# EAGLE design v2_guc_dagıtım_savasan (EAGLE 9.6.2)
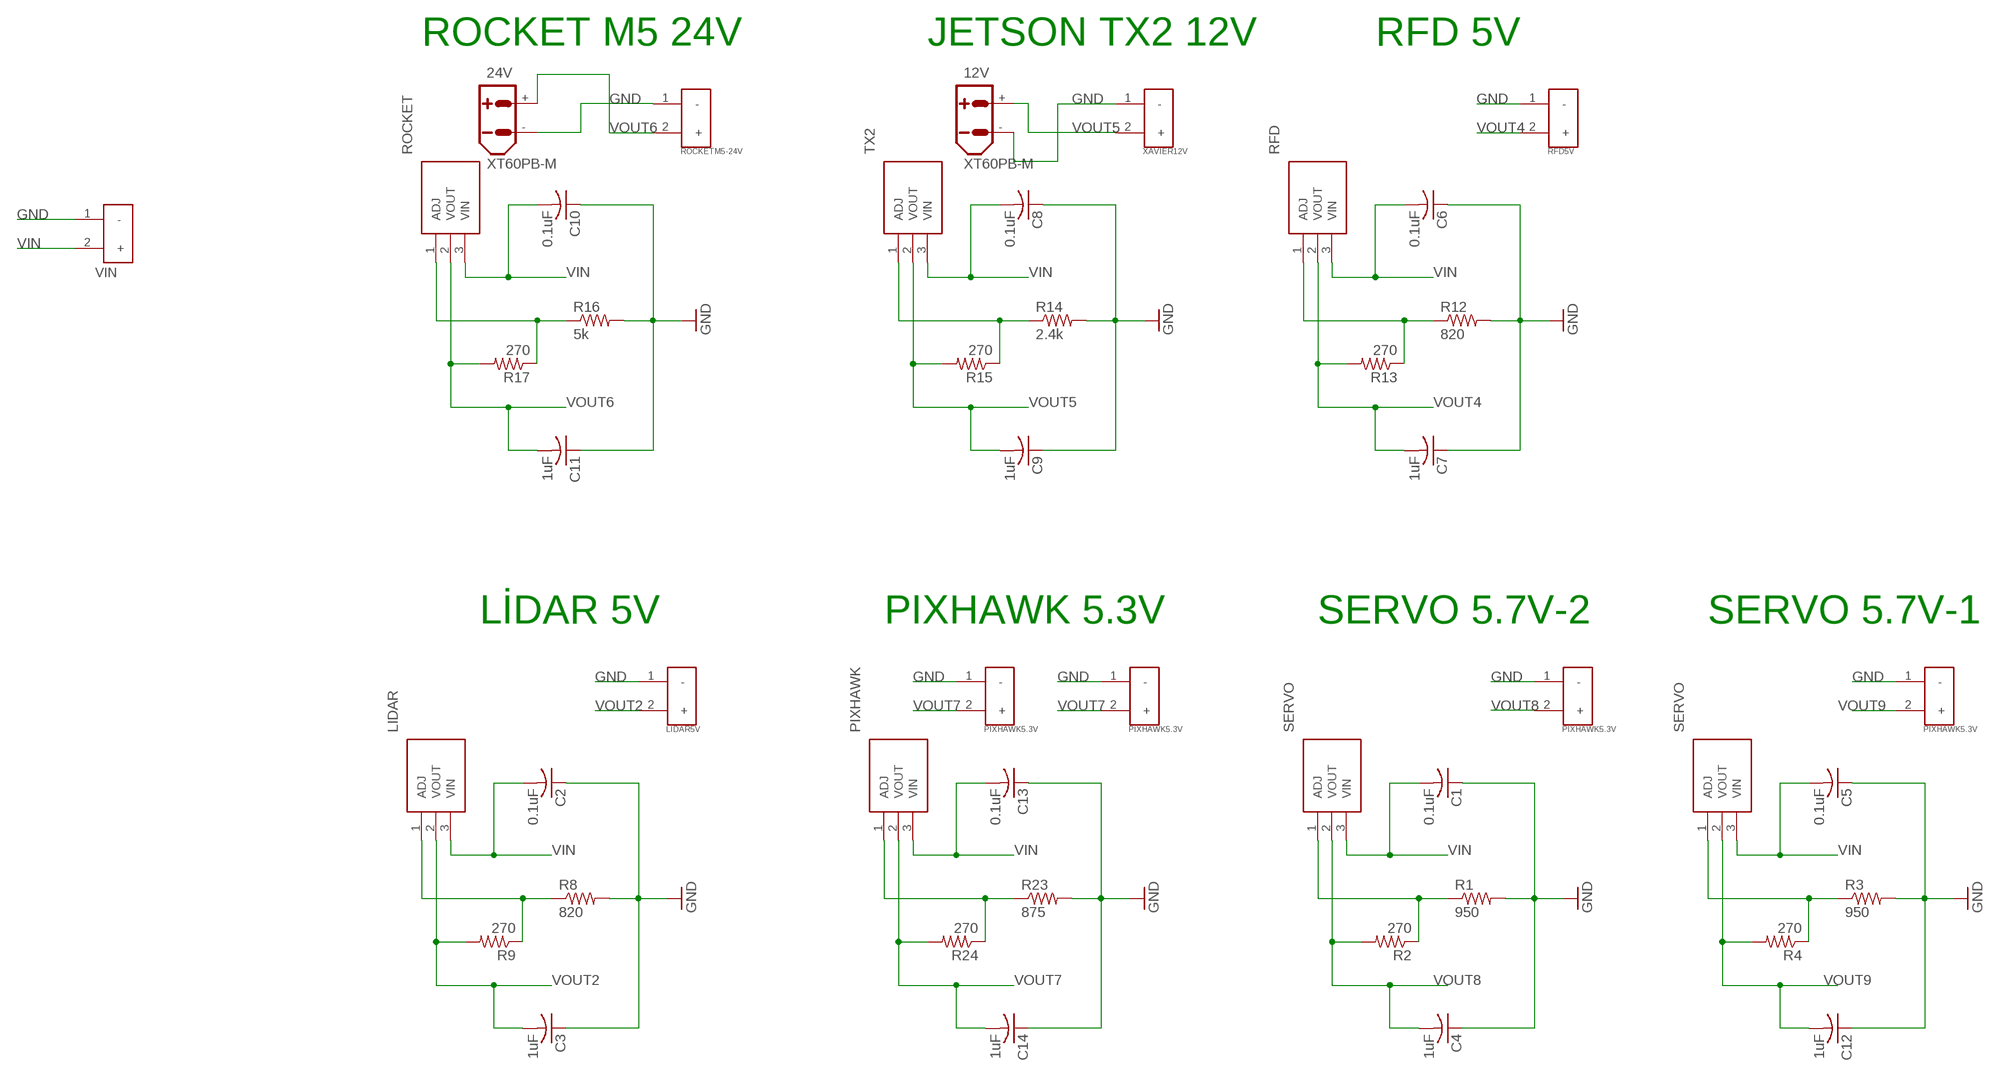
[diagram p0: schematic, sheet 1]

## Parts
12V  XT60PB-M  [XT60PB-M]
24V  XT60PB-M  [XT60PB-M]
C1  0.1uF  C-USC0402K  [C0402K]
C2  0.1uF  C-USC0402K  [C0402K]
C3  1uF  C-USC0402K  [C0402K]
C4  1uF  C-USC0402K  [C0402K]
C5  0.1uF  C-USC0402K  [C0402K]
C6  0.1uF  C-USC0402K  [C0402K]
C7  1uF  C-USC0402K  [C0402K]
C8  0.1uF  C-USC0402K  [C0402K]
C9  1uF  C-USC0402K  [C0402K]
C10  0.1uF  C-USC0402K  [C0402K]
C11  1uF  C-USC0402K  [C0402K]
C12  1uF  C-USC0402K  [C0402K]
C13  0.1uF  C-USC0402K  [C0402K]
C14  1uF  C-USC0402K  [C0402K]
IC5  LIDAR  LM338T_NOPB  [TO254P470X1028X1955-3P]
IC7  RFD  LM338T_NOPB  [TO254P470X1028X1955-3P]
IC8  TX2  LM338T_NOPB  [TO254P470X1028X1955-3P]
IC9  ROCKET  LM338T_NOPB  [TO254P470X1028X1955-3P]
IC13  PIXHAWK  LM338T_NOPB  [TO254P470X1028X1955-3P]
J3  VIN  XT60-M  [AMASS_XT60-M]
LIDAR5V  LIDAR5V  XT60-M  [AMASS_XT60-M]
PIXHAWK5.3V-1  PIXHAWK5.3V  XT60-M  [AMASS_XT60-M]
PIXHAWK5.3V-2  PIXHAWK5.3V  XT60-M  [AMASS_XT60-M]
R1  950  R-US_R0805  [R0805]
R2  270  R-US_R0805  [R0805]
R3  950  R-US_R0805  [R0805]
R4  270  R-US_R0805  [R0805]
R8  820  R-US_R0805  [R0805]
R9  270  R-US_R0805  [R0805]
R12  820  R-US_R0805  [R0805]
R13  270  R-US_R0805  [R0805]
R14  2.4k  R-US_R0805  [R0805]
R15  270  R-US_R0805  [R0805]
R16  5k  R-US_R0805  [R0805]
R17  270  R-US_R0805  [R0805]
R23  875  R-US_R0805  [R0805]
R24  270  R-US_R0805  [R0805]
RFD5V  RFD5V  XT60-M  [AMASS_XT60-M]
ROCKETM5-24V  ROCKETM5-24V  XT60-M  [AMASS_XT60-M]
SERVO5.7V-1  PIXHAWK5.3V  XT60-M  [AMASS_XT60-M]
SERVO5.7V-2  PIXHAWK5.3V  XT60-M  [AMASS_XT60-M]
SERVO-1  SERVO  LM338T_NOPB  [TO254P470X1028X1955-3P]
SERVO-2  SERVO  LM338T_NOPB  [TO254P470X1028X1955-3P]
TX2-12V  XAVIER12V  XT60-M  [AMASS_XT60-M]

## Nets
GND [asda]: 12V.- 24V.- C1.1 C2.1 C3.1 C4.1 C5.1 C6.1 C7.1 C8.1 C9.1 C10.1 C11.1 C12.1 C13.1 C14.1 J3.1(-) LIDAR5V.1(-) PIXHAWK5.3V-1.1(-) PIXHAWK5.3V-2.1(-) R1.2 R3.2 R8.2 R12.2 R14.2 R16.2 R23.2 RFD5V.1(-) ROCKETM5-24V.1(-) SERVO5.7V-1.1(-) SERVO5.7V-2.1(-) TX2-12V.1(-)
N$1: R1.1 R2.1 SERVO-2.1(ADJ)
N$2: R3.1 R4.1 SERVO-1.1(ADJ)
N$11: IC7.1(ADJ) R12.1 R13.1
N$12: IC5.1(ADJ) R8.1 R9.1
N$13: IC8.1(ADJ) R14.1 R15.1
N$14: IC9.1(ADJ) R16.1 R17.1
N$17: IC13.1(ADJ) R23.1 R24.1
VIN [asda]: C1.2 C2.2 C5.2 C6.2 C8.2 C10.2 C13.2 IC5.3(VIN) IC7.3(VIN) IC8.3(VIN) IC9.3(VIN) IC13.3(VIN) J3.2(+) SERVO-1.3(VIN) SERVO-2.3(VIN)
VOUT2: C3.2 IC5.2(VOUT) LIDAR5V.2(+) R9.2
VOUT4: C7.2 IC7.2(VOUT) R13.2 RFD5V.2(+)
VOUT5: 12V.+ C9.2 IC8.2(VOUT) R15.2 TX2-12V.2(+)
VOUT6: 24V.+ C11.2 IC9.2(VOUT) R17.2 ROCKETM5-24V.2(+)
VOUT7: C14.2 IC13.2(VOUT) PIXHAWK5.3V-1.2(+) PIXHAWK5.3V-2.2(+) R24.2
VOUT8: C4.2 R2.2 SERVO5.7V-2.2(+) SERVO-2.2(VOUT)
VOUT9: C12.2 R4.2 SERVO5.7V-1.2(+) SERVO-1.2(VOUT)

## Notes on the sheet
- ROCKET M5 24V | JETSON TX2 12V | RFD 5V
- LİDAR 5V | PIXHAWK 5.3V | SERVO 5.7V-2 | SERVO 5.7V-1

## Library data of the parts
12V 24V = amass:XT60: AMASS XT60 connector Store in Japan AMASS XT60 connector <https://szc.jp/ams-xt60>
C1-C14 = adafruit:C-US: CAPACITOR, American symbol
IC5 IC7-IC9 IC13 SERVO-1 SERVO-2 = LM338T_NOPB:LM338T_NOPB: 5 Amp Adjustable Regulator LM338T LM338T/NOPB, Voltage Regulator, 5A Adjustable 1.2 32 V, 25W, 3-Pin TO-220 Source: Datasheet <http://www.ti.com/lit/ds/symlink/lm338.pdf>; ARROW_PART_NUMBER: LM338T/NOPB; ARROW_PRICE-STOCK: https://www.arrow.com/en/products/lm338tnopb/texas-instruments; DESCRIPTION: 5 Amp Adjustable Regulator LM338T LM338T/NOPB, Voltage Regulator, 5A Adjustable 1.2 32 V, 25W, 3-Pin TO-220; HEIGHT: 4.7mm; MANUFACTURER_NAME: Texas Instruments; MANUFACTURER_PART_NUMBER: LM338T/NOPB; MOUSER_PART_NUMBER: 926-LM338T/NOPB; MOUSER_PRICE-STOCK: https://www.mouser.co.uk/ProductDetail/Texas-Instruments/LM338T-NOPB?qs=X1J7HmVL2ZENaH7%2FMvkSlw%3D%3D
J3 LIDAR5V PIXHAWK5.3V-1 PIXHAWK5.3V-2 RFD5V ROCKETM5-24V SERVO5.7V-1 SERVO5.7V-2 TX2-12V = XT60-M:XT60-M: DC supply; XT60; male; PIN:2; for cable; soldered; 60A; 500V; AVAILABILITY: Unavailable; DESCRIPTION: Plug; DC supply; XT60; male; PIN: 2; for cable; soldered; 30A; 500V; MF: AMASS; MP: XT60-M; PACKAGE: Package; PRICE: None
R1-R4 R8 R9 R12-R17 R23 R24 = adafruit:R-US_: RESISTOR, American symbol

## Net classes
1 asda: width 0.7 mm

## Board
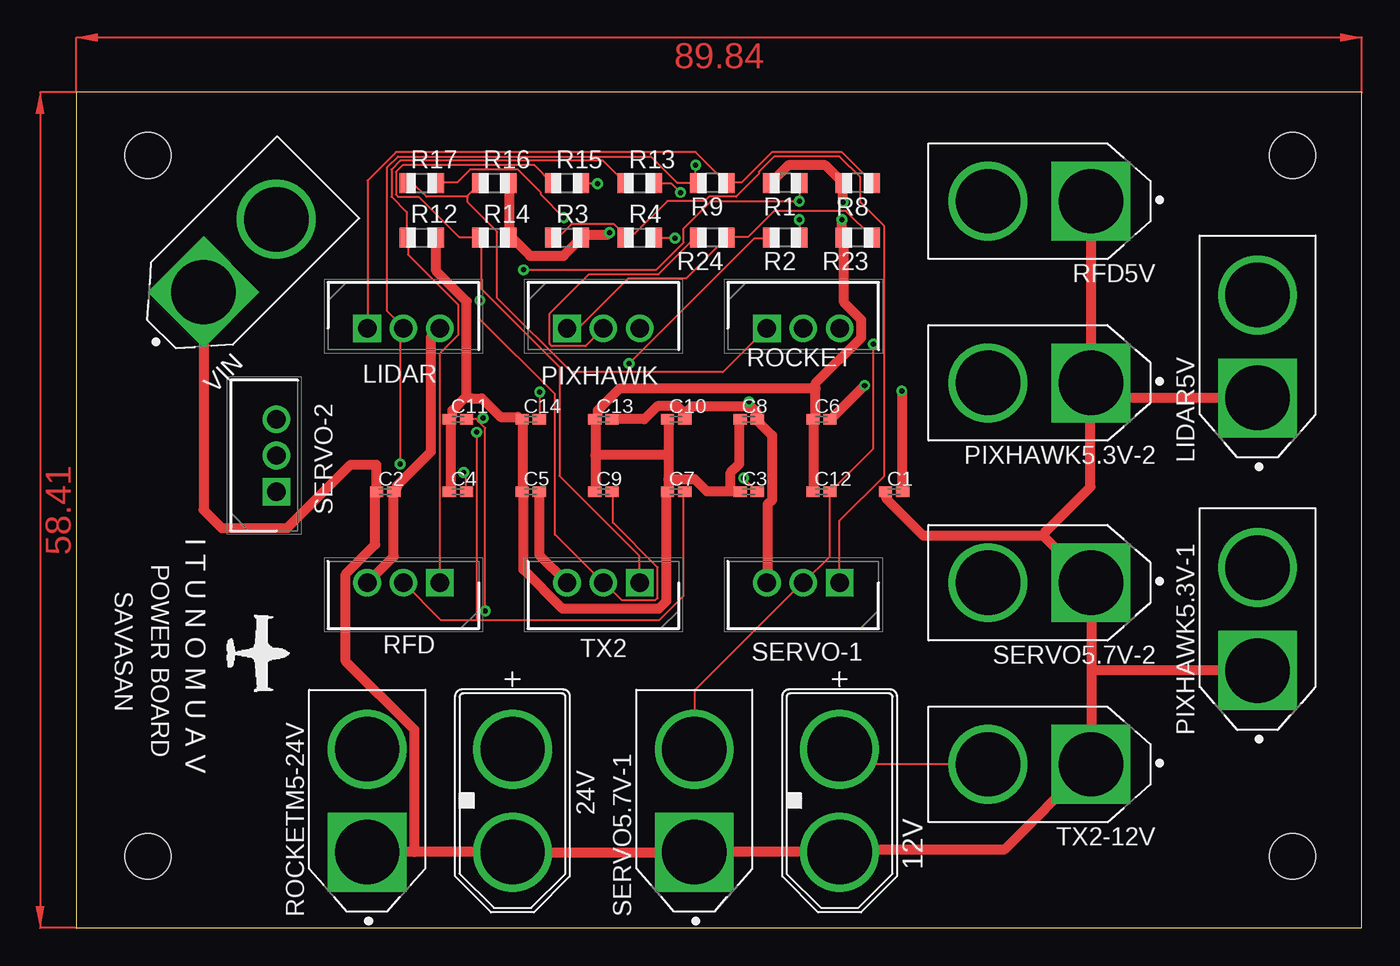
[diagram p1: board, top side]
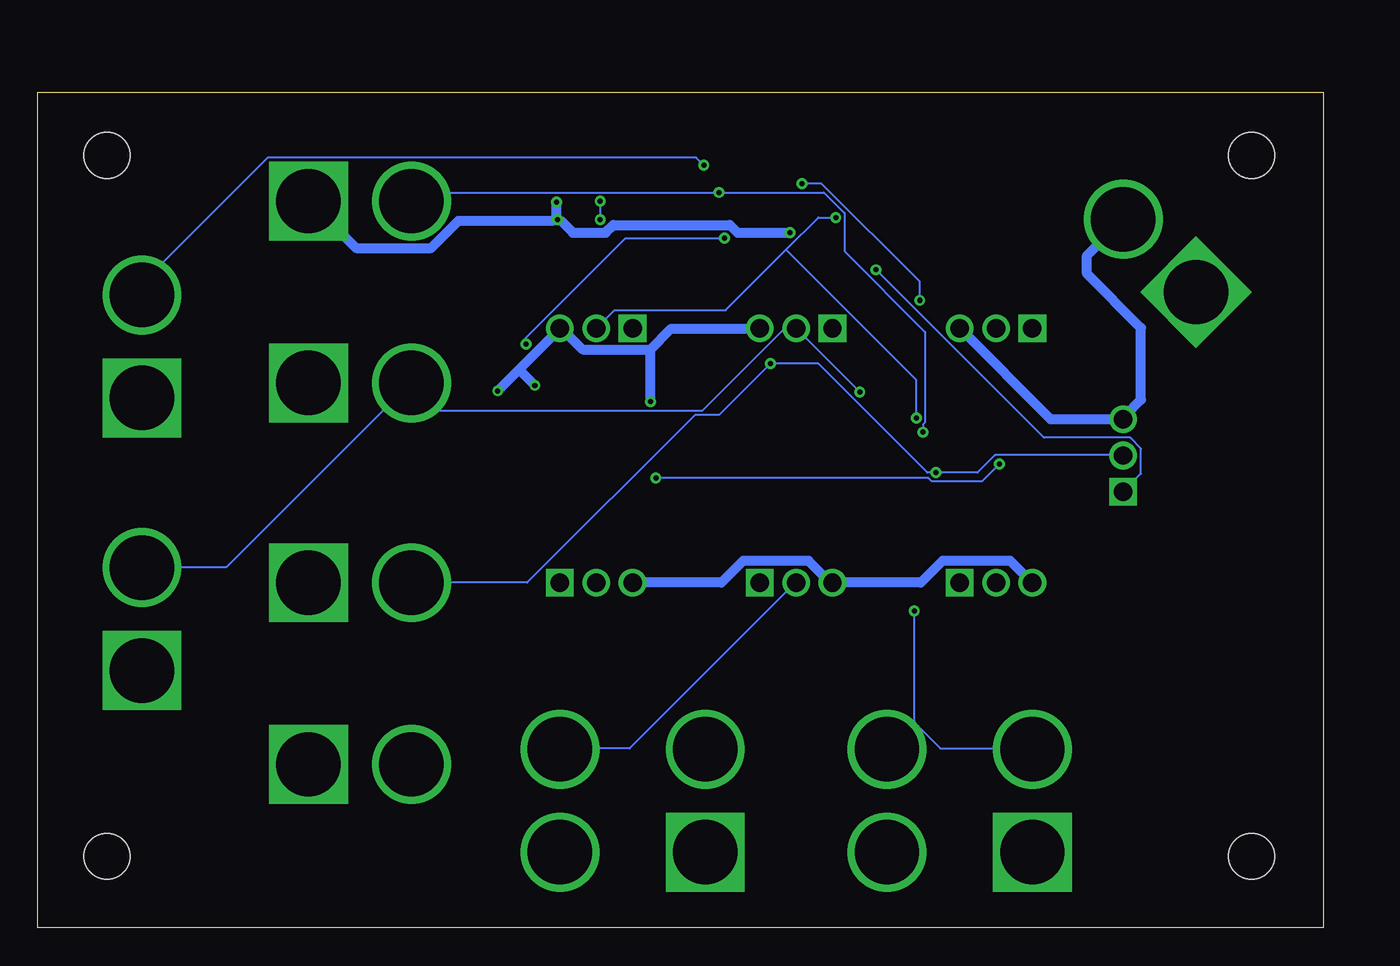
[diagram p2: board, bottom side, seen from below]

Size 89.84 x 58.41 mm. Coordinates in mm from the lower left corner, seen from the top.
Outline: 0,0 89.84,0 89.84,58.41 0,58.41 0,0
Copper layers (1*16): Top 0.035mm / dielectric 1.5mm / Bottom 0.035mm
Design rules "default *": minimum track width 6mil, minimum drill 0.35mm, track to track 6mil, track to pad 6mil, pad to pad 6mil, via to via 6mil, smd to smd 6mil, copper to edge 40mil, drill to drill 6mil, minimum pad ring 10mil, minimum via ring 8mil, stop-mask expansion 4mil, vias tented up to drill 0mil, thermal gap 10mil
Holes 3.2 mm at 5,54 5,5 85,5 85,54

### Footprints (pad centres in the part's own frame; a part is rotated, then mirrored left to right if it is on the bottom)
XT60PB-M = drill 4.5: + 3.6,0; - -3.6,0
C0402K = smd 0.925 x 0.74: 1 -0.6,0; 2 0.6,0
TO254P470X1028X1955-3P = drill 1.29 pad 1.935 square: 1 0,0 | drill 1.29 pad 1.935: 2 2.54,0; 3 5.08,0
AMASS_XT60-M = drill 4.5 square: 1 -3.6,0 | drill 4.5: 2 3.6,0
R0805 = smd 1.1 x 1.4: 1 -1,0; 2 1,0

### Placement (x,y rotation side)
12V  53.34,8.89 90 top
24V  30.48,8.89 90 top
C1  57.15,30.48 0 top
C2  21.59,30.48 0 top
C3  46.99,30.48 0 top
C4  26.67,30.48 0 top
C5  31.75,30.48 0 top
C6  52.07,35.56 0 top
C7  41.91,30.48 0 top
C8  46.99,35.56 0 top
C9  36.83,30.48 0 top
C10  41.91,35.56 0 top
C11  26.67,35.56 0 top
C12  52.07,30.48 0 top
C13  36.83,35.56 0 top
C14  31.75,35.56 0 top
IC5  20.32,41.91 0 top
IC7  25.4,24.13 180 top
IC8  39.37,24.13 180 top
IC9  48.26,41.91 0 top
IC13  34.29,41.91 0 top
J3  11.43,46.99 45 top
LIDAR5V  82.55,40.64 90 top
PIXHAWK5.3V-1  82.55,21.59 90 top
PIXHAWK5.3V-2  67.31,38.1 180 top
R1  49.53,52.07 180 top
R2  49.53,48.26 180 top
R3  34.29,48.26 0 top
R4  39.37,48.26 0 top
R8  54.61,52.07 180 top
R9  44.45,52.07 180 top
R12  24.13,48.26 0 top
R13  39.37,52.07 0 top
R14  29.21,48.26 0 top
R15  34.29,52.07 0 top
R16  29.21,52.07 0 top
R17  24.13,52.07 0 top
R23  54.61,48.26 180 top
R24  44.45,48.26 180 top
RFD5V  67.31,50.8 180 top
ROCKETM5-24V  20.32,8.89 90 top
SERVO5.7V-1  43.18,8.89 90 top
SERVO5.7V-2  67.31,24.13 180 top
SERVO-1  53.34,24.13 180 top
SERVO-2  13.97,30.48 90 top
TX2-12V  67.31,11.43 180 top

### Tracks (layer width: path | path; a pad name or v marks a point on that pad's centre or on a via)
GND  (via drill 0.35)
  Top 0.7: 23.62,5.31 30.48,5.31 24V.- 30.79,5.23 42.82,5.23 SERVO5.7V-1.1 43.2,5.31 53.34,5.31 12V.- 53.65,5.46 64.85,5.46 70.64,11.25 TX2-12V.1 70.94,11.48 70.94,18.03 | 23.62,5.31 20.34,5.31 ROCKETM5-24V.1 | 23.62,5.31 23.62,13.84 18.82,18.64 18.82,24.74 20.88,26.8 20.88,30.15 C2.1 20.95,30.53 20.95,32.36 20.93,32.38 19.18,32.38 14.73,27.94 10.16,27.94 8.88,29.22 J3.1 | C4.1 26.14,30.53 26.14,35.56 C11.1 26.29,35.87 26.29,36.17 27.28,37.16 | 27.28,37.16 27.28,43.79 25.15,45.92 25.15,48.21 R12.2 | 27.28,37.16 27.58,37.01 28.35,37.01 29.64,35.71 30.86,35.71 C14.1 31.17,35.56 31.17,30.53 C5.1 31.24,30.15 31.24,25.04 33.98,22.3 40.69,22.3 41.22,22.84 41.22,30.15 C7.1 41.38,30.53 41.38,31.37 | 36.27,33.05 36.27,35.56 C13.1 36.42,35.87 36.42,36.17 37.95,37.69 51.66,37.69 | 36.27,33.05 36.27,30.53 C9.1 | 41.38,33.05 41.38,35.56 C10.1 | 41.38,33.05 41.38,31.37 | 45.72,30.53 44.04,30.53 43.2,31.37 41.38,31.37 | 45.72,30.53 46.33,30.53 C3.1 | 45.72,30.53 45.72,31.83 46.33,32.44 46.33,35.56 C8.1 | 41.38,33.05 36.27,33.05 | R16.2 30.25,52.02 30.25,48.28 R14.2 30.56,48.13 31.7,46.99 34.06,46.99 35.28,48.21 R3.2 35.59,48.44 37.11,48.44 v37.26,48.59 | R1.2 48.54,52.09 49.76,53.31 52.35,53.31 53.57,52.09 R8.2 53.57,51.71 v53.57,50.72 | C12.1 51.51,30.53 51.51,35.56 C6.1 51.66,35.87 51.66,37.69 | 51.66,37.69 51.66,38.08 54.86,41.27 54.86,42.49 53.65,43.71 53.65,48.21 R23.2 53.49,48.59 v53.49,49.51 | 67.59,27.41 59.21,27.41 56.62,30 56.62,30.45 C1.1 | 67.59,27.41 70.87,24.13 SERVO5.7V-2.1 70.94,23.82 70.94,18.03 | 70.94,18.03 82.53,18.03 PIXHAWK5.3V-1.1 | PIXHAWK5.3V-2.1 70.87,38.08 70.87,30.84 67.74,27.71 67.59,27.41
  Top 0.7: LIDAR5V.1 82.53,37.08 71.17,37.08 PIXHAWK5.3V-2.1 | RFD5V.1 70.94,50.8 70.94,38.46 PIXHAWK5.3V-2.1
  Bottom 0.7: 53.57,49.58 v53.57,50.72 | 53.57,49.58 v53.49,49.51 53.19,49.35 52.43,48.59 50.14,48.59 49.61,49.12 41.45,49.12 40.92,48.59 v37.26,48.59 | 53.57,49.58 53.87,49.43 60.43,49.43 62.33,47.52 67.59,47.52 70.87,50.8 RFD5V.1
N$1  (via drill 0.35)
  Top 0.152: v50.52,49.51 50.52,48.28 R2.1 | R1.1 50.52,52.02 v50.52,50.8 44.35,50.8 42.44,48.9 42.44,47.9 40.54,46 v31.24,46
  Bottom 0.152: v50.52,50.8 v50.52,49.51 | v31.24,46 19.51,34.27 13.49,34.27 12.72,33.5 12.72,31.75 13.95,30.53 SERVO-2.1
N$2
  Top 0.152: R3.1 33.3,48.28 33.68,48.28 34.59,49.2 37.57,49.2 38.33,48.44 38.33,48.28 R4.1 38.33,48.51 39.01,48.51 41.3,50.8 43.89,50.8 44.2,51.1 46.1,51.1 47.7,52.7 47.7,52.86 48.77,53.92 53.34,53.92 54.79,52.48 54.79,50.72 56.46,49.05 56.46,31.6 53.34,28.47 SERVO-1.1
N$11
  Top 0.152: R13.1 38.33,52.09 36.8,53.62 22.63,53.62 22.02,53.01 22.02,51.1 23.09,50.04 23.09,48.28 R12.1 23.16,48.21 23.16,47.07 26.67,43.56 26.67,41.43 25.38,40.13 25.38,24.13 IC7.1
N$12
  Top 0.152: R8.1 55.63,52.09 53.49,54.23 48.62,54.23 46.48,52.09 45.49,52.09 R9.1 45.41,52.09 43.28,54.23 22.33,54.23 20.34,52.25 20.34,41.96 IC5.1
N$13
  Top 0.152: R15.1 33.22,52.09 32,53.31 22.78,53.31 22.33,52.86 22.33,51.26 22.48,51.1 23.93,51.1 26.75,48.28 28.19,48.28 R14.1 28.27,48.21 28.27,44.7 33.76,39.22 33.76,31.6 39.32,26.04 39.32,24.13 IC8.1
N$14
  Top 0.152: 27.32,51.14 28.19,52.02 R16.1 | 27.32,51.14 27.28,51.1 24.46,51.1 23.55,52.02 23.16,52.02 R17.1 | IC9.1 45.19,38.84 34.59,38.84 29.41,44.02 29.41,48.67 27.36,50.72 27.36,51.1 27.32,51.14
N$17
  Top 0.152: R23.1 55.63,48.28 53.8,50.11 48.77,50.11 46.94,48.28 45.49,48.28 R24.1 45.41,48.21 42.6,45.39 38.56,45.39 35.13,41.96 34.29,41.96 IC13.1
VIN  (via drill 0.35)
  Top 0.7: v57.68,37.54 57.68,30.53 C1.2 | v55.09,37.92 52.73,35.56 C6.2 | C13.2 39.7,35.56 40.62,36.47 41.99,36.47 42.44,36.02 | 42.44,36.02 42.44,35.56 C10.2 | 47.09,36.47 47.55,36.02 47.55,35.56 C8.2 47.78,35.26 48.62,34.42 48.62,29.92 48.31,29.62 48.31,24.13 SERVO-1.3 | 47.09,36.47 43.05,36.47 42.75,36.17 42.44,36.02 | IC8.3 32.38,26.04 32.38,30.45 C5.2 | IC7.3 20.34,24.13 22.17,25.96 22.17,30.45 C2.2 22.4,30.76 22.4,30.91 24.77,33.27 24.77,41.27 IC5.3 | v47.02,36.78 47.09,36.47
  Bottom 0.7: 56.2,39.03 53.34,41.88 IC9.3 53.03,41.73 51.74,40.44 47.02,40.44 | 56.2,39.03 v57.68,37.54 | 56.2,39.03 v55.09,37.92 | 47.02,40.44 45.57,41.88 39.4,41.88 IC13.3 | IC5.3 19.05,35.56 SERVO-2.3 13.79,35.87 12.72,36.93 12.72,41.94 16.51,45.72 16.51,47 J3.2 | IC7.3 20.34,24.13 21.87,25.65 26.59,25.65 28.12,24.13 IC8.3 34.59,24.28 35.97,25.65 40.54,25.65 42.06,24.13 SERVO-1.3 | v47.02,36.78 47.02,40.44
VOUT2  (via drill 0.35)
  Top 0.152: v46.63,31.45 47.55,30.53 C3.2 | v22.63,32.44 22.63,41.66 22.86,41.88 IC5.2 22.86,41.96 21.72,43.1 21.72,53.16 22.48,53.92 40.16,53.92 41.99,52.09 43.28,52.09 | 43.28,52.09 43.43,52.09 R9.2 43.28,52.09 | 43.28,52.09 v43.28,53.31
  Bottom 0.152: v46.63,31.45 27.58,31.45 27.36,31.22 23.85,31.22 v22.63,32.44 | v43.28,53.31 43.81,53.85 73.76,53.85 82.53,45.09 82.53,44.25 LIDAR5V.2
VOUT4  (via drill 0.35)
  Top 0.152: 27.96,21.54 25.45,21.54 IC7.2 | 27.96,21.54 40.77,21.54 42.44,23.22 42.44,30.45 C7.2 | v42.22,51.41 41.6,52.02 40.39,52.02 R13.2 | v27.96,34.65 27.96,21.54
  Bottom 0.152: RFD5V.2 63.09,51.41 v42.22,51.41 34.9,51.41 33.45,49.96 33.45,47.3 27.81,41.66 27.81,35.33 27.96,35.18 v27.96,34.65
VOUT5  (via drill 0.35)
  Top 0.152: TX2-12V.2 63.7,11.48 54.33,11.48 53.34,12.47 12V.+ | C9.2 37.49,30.45 37.49,28.32 40.62,25.2 40.62,23.06 40.46,22.91 38.1,22.91 36.88,24.13 IC8.2 36.8,24.13 33.45,27.48 33.45,37.31 28.19,42.57 v28.19,43.87 | v36.42,52.02 35.36,52.02 R15.2
  Bottom 0.152: v36.42,52.02 35.05,52.02 28.19,45.16 v28.19,43.87 | 12V.+ 53.34,12.55 48.46,12.55 36.88,24.13 IC8.2
VOUT6  (via drill 0.35)
  Top 0.152: v34.06,49.66 32.46,51.26 32.46,51.41 30.86,53.01 27.51,53.01 26.59,52.09 25.15,52.09 R17.2 | C11.2 27.96,35.56 28.16,35.37 | 28.16,35.37 28.57,34.95 v28.57,22.15 | 28.16,35.37 v28.42,35.64
  Bottom 0.152: v34.06,49.66 35.28,49.66 37.53,47.41 | 37.53,47.41 41.76,43.18 49.53,43.18 IC9.2 | v28.57,22.15 28.57,14.45 30.48,12.55 24V.+ 28.57,14.38 26.75,12.55 20.34,12.55 ROCKETM5-24V.2 | 37.53,47.41 28.42,38.3 v28.42,35.64
VOUT7  (via drill 0.35)
  Top 0.152: v32.38,37.47 32.38,35.56 C14.2 | IC13.2 35.59,40.66 33.22,40.66 33.07,40.82 33.07,42.95 35.81,45.7 40.69,45.7 43.2,48.21 43.43,48.21 R24.2
  Bottom 0.152: v32.38,37.47 IC13.2 36.88,41.88 37.64,41.88 43.36,36.17 61.8,36.17 63.7,38.08 PIXHAWK5.3V-2.2 63.78,38.08 76.66,25.2 82.53,25.2 PIXHAWK5.3V-1.2
VOUT8  (via drill 0.35)
  Top 0.152: v27.05,31.83 27.2,31.67 27.2,30.53 C4.2 | v38.63,39.45 47.4,48.21 48.46,48.21 R2.2
  Bottom 0.152: SERVO-2.2 14.02,33.05 22.94,33.05 24.16,31.83 v27.05,31.83 27.66,31.83 35.28,39.45 v38.63,39.45 42.22,35.87 43.89,35.87 55.63,24.13 SERVO5.7V-2.2
VOUT9  (via drill 0.35)
  Top 0.152: v41.83,48.21 40.39,48.21 R4.2 | v55.7,40.82 55.7,33.5 52.73,30.53 C12.2 52.65,30.45 52.65,25.96 50.83,24.13 SERVO-1.2 50.75,24.13 43.2,16.59 43.2,12.55 SERVO5.7V-1.2
  Bottom 0.152: v41.83,48.21 48.77,48.21 55.7,41.27 v55.7,40.82
(copper drawn outside any net)
  shapes: Top area x2

### Text on the board
tNames: SAVASAN | POWER BOARD | I T U N O M U A V